# EAGLE design Switch Decoderv04a (EAGLE 8.2.2)
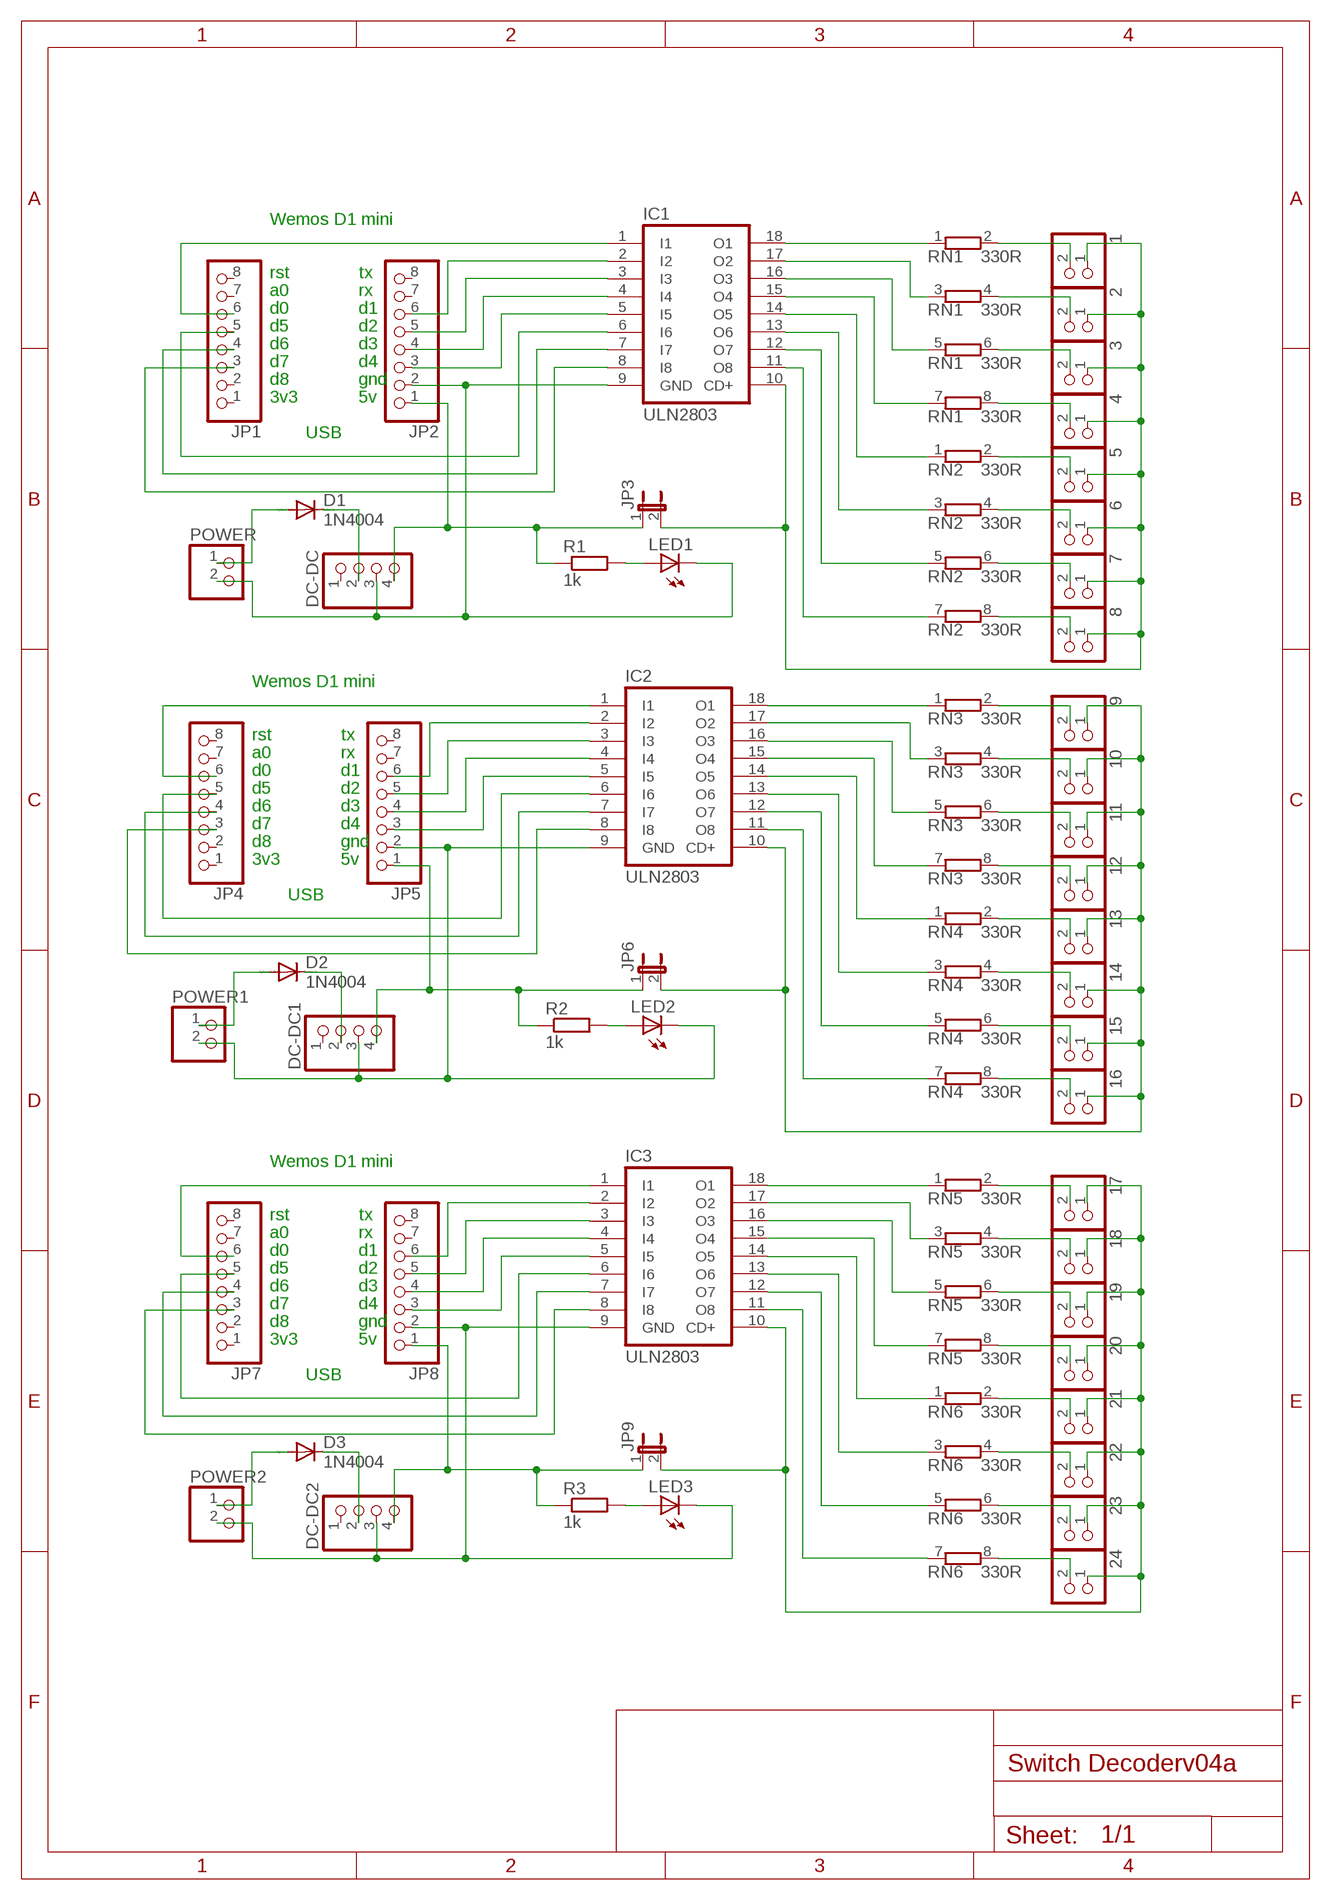
[diagram p0: schematic, sheet 1]

## Parts
1  PINHD-1X2  [1X02]
2  PINHD-1X2  [1X02]
3  PINHD-1X2  [1X02]
4  PINHD-1X2  [1X02]
5  PINHD-1X2  [1X02]
6  PINHD-1X2  [1X02]
7  PINHD-1X2  [1X02]
8  PINHD-1X2  [1X02]
9  PINHD-1X2  [1X02]
10  PINHD-1X2  [1X02]
11  PINHD-1X2  [1X02]
12  PINHD-1X2  [1X02]
13  PINHD-1X2  [1X02]
14  PINHD-1X2  [1X02]
15  PINHD-1X2  [1X02]
16  PINHD-1X2  [1X02]
17  PINHD-1X2  [1X02]
18  PINHD-1X2  [1X02]
19  PINHD-1X2  [1X02]
20  PINHD-1X2  [1X02]
21  PINHD-1X2  [1X02]
22  PINHD-1X2  [1X02]
23  PINHD-1X2  [1X02]
24  PINHD-1X2  [1X02]
D1  1N4004  [DO41-10]
D2  1N4004  [DO41-10]
D3  1N4004  [DO41-10]
DC-DC  PINHD-1X4  [1X04]
DC-DC1  PINHD-1X4  [1X04]
DC-DC2  PINHD-1X4  [1X04]
IC1  ULN2803  ULN2803A  [DIL18]
IC2  ULN2803  ULN2803A  [DIL18]
IC3  ULN2803  ULN2803A  [DIL18]
JP1  PINHD-1X8  [1X08]
JP2  PINHD-1X8  [1X08]
JP3  JP1E  [JP1]
JP4  PINHD-1X8  [1X08]
JP5  PINHD-1X8  [1X08]
JP6  JP1E  [JP1]
JP7  PINHD-1X8  [1X08]
JP8  PINHD-1X8  [1X08]
JP9  JP1E  [JP1]
LED1  LED3MM  [LED3MM]
LED2  LED3MM  [LED3MM]
LED3  LED3MM  [LED3MM]
POWER  PINHD-1X2  [1X02]
POWER1  PINHD-1X2  [1X02]
POWER2  PINHD-1X2  [1X02]
R1  1k  R-EU_0309/10  [0309/10]
R2  1k  R-EU_0309/10  [0309/10]
R3  1k  R-EU_0309/10  [0309/10]
RN1  330R  E4RP  [SIL8]
RN2  330R  E4RP  [SIL8]
RN3  330R  E4RP  [SIL8]
RN4  330R  E4RP  [SIL8]
RN5  330R  E4RP  [SIL8]
RN6  330R  E4RP  [SIL8]

## Nets
N$1 [Gnd]: DC-DC.3 IC1.9(GND) JP2.2 LED1.K(C) POWER.2
N$2: IC1.1(I1) JP1.6
N$3: IC1.7(I7) JP1.4
N$4 [5V]: D1.C DC-DC.2
N$5: IC1.6(I6) JP1.5
N$6: LED1.A R1.2
N$7: IC1.3(I3) JP2.5
N$8 [5V]: 1.1 2.1 3.1 4.1 5.1 6.1 7.1 8.1 IC1.10(CD+) JP3.2
N$9: IC1.5(I5) JP2.3
N$10: IC1.2(I2) JP2.6
N$11: IC1.8(I8) JP1.3
N$12: IC1.18(O1) RN1.1
N$13: IC1.4(I4) JP2.4
N$14: IC2.1(I1) JP4.6
N$15 [Gnd]: 1.2 RN1.2
N$16 [5V]: 9.1 10.1 11.1 12.1 13.1 14.1 15.1 16.1 IC2.10(CD+) JP6.2
N$17 [Gnd]: IC1.17(O2) RN1.3
N$18 [Gnd]: 2.2 RN1.4
N$19 [Gnd]: 3.2 RN1.6
N$20 [Gnd]: IC1.16(O3) RN1.5
N$21 [Gnd]: IC1.15(O4) RN1.7
N$22 [Gnd]: 4.2 RN1.8
N$23 [Gnd]: 5.2 RN2.2
N$24 [Gnd]: IC1.14(O5) RN2.1
N$25 [Gnd]: IC1.13(O6) RN2.3
N$26 [Gnd]: 6.2 RN2.4
N$27 [Gnd]: 7.2 RN2.6
N$28 [Gnd]: IC1.12(O7) RN2.5
N$29 [Gnd]: 8.2 RN2.8
N$30: LED2.A R2.2
N$31: IC2.2(I2) JP5.6
N$32: IC2.3(I3) JP5.5
N$33: IC2.4(I4) JP5.4
N$34 [5V]: D2.A POWER1.1
N$35 [5V]: D2.C DC-DC1.2
N$36: IC2.5(I5) JP5.3
N$37: IC2.6(I6) JP4.5
N$38: IC2.7(I7) JP4.4
N$39: IC2.8(I8) JP4.3
N$40: IC3.18(O1) RN5.1
N$41 [Gnd]: DC-DC1.3 IC2.9(GND) JP5.2 LED2.K(C) POWER1.2
N$42: IC1.11(O8) RN2.7
N$43 [Gnd]: IC2.11(O8) RN4.7
N$44: IC2.18(O1) RN3.1
N$45 [Gnd]: IC2.17(O2) RN3.3
N$46 [Gnd]: 9.2 RN3.2
N$47 [5V]: D1.A POWER.1
N$48 [Gnd]: 10.2 RN3.4
N$49 [Gnd]: IC2.16(O3) RN3.5
N$50 [Gnd]: IC2.15(O4) RN3.7
N$51 [Gnd]: 11.2 RN3.6
N$52 [Gnd]: 12.2 RN3.8
N$53 [Gnd]: IC2.14(O5) RN4.1
N$54 [Gnd]: IC2.13(O6) RN4.3
N$55 [Gnd]: 13.2 RN4.2
N$56 [Gnd]: 14.2 RN4.4
N$57 [Gnd]: IC2.12(O7) RN4.5
N$58 [Gnd]: 15.2 RN4.6
N$59: IC3.1(I1) JP7.6
N$60: LED3.A R3.2
N$61: IC3.2(I2) JP8.6
N$62: IC3.3(I3) JP8.5
N$63: IC3.4(I4) JP8.4
N$64 [5V]: D3.A POWER2.1
N$65 [5V]: D3.C DC-DC2.2
N$66: IC3.5(I5) JP8.3
N$67: IC3.6(I6) JP7.5
N$68: IC3.7(I7) JP7.4
N$69: IC3.8(I8) JP7.3
N$70 [5V]: 17.1 18.1 19.1 20.1 21.1 22.1 23.1 24.1 IC3.10(CD+) JP9.2
N$71 [Gnd]: DC-DC2.3 IC3.9(GND) JP8.2 LED3.K(C) POWER2.2
N$72 [Gnd]: 16.2 RN4.8
N$73 [Gnd]: IC3.11(O8) RN6.7
N$74 [5V]: DC-DC.4 JP2.1 JP3.1 R1.1
N$75 [Gnd]: IC3.17(O2) RN5.3
N$76 [5V]: DC-DC1.4 JP5.1 JP6.1 R2.1
N$77 [5V]: DC-DC2.4 JP8.1 JP9.1 R3.1
N$78 [Gnd]: IC3.16(O3) RN5.5
N$79 [Gnd]: IC3.15(O4) RN5.7
N$81 [Gnd]: 17.2 RN5.2
N$82 [Gnd]: IC3.14(O5) RN6.1
N$83 [Gnd]: IC3.13(O6) RN6.3
N$84 [Gnd]: 18.2 RN5.4
N$85 [Gnd]: 19.2 RN5.6
N$86 [Gnd]: IC3.12(O7) RN6.5
N$87 [Gnd]: 20.2 RN5.8
N$88 [Gnd]: 21.2 RN6.2
N$89 [Gnd]: 22.2 RN6.4
N$90 [extra]: 23.2 RN6.6
N$91 [Gnd]: 24.2 RN6.8
Unconnected: DC-DC1.1 DC-DC2.1 DC-DC.1 JP1.1 JP1.2 JP1.7 JP1.8 JP2.7 JP2.8 JP4.1 JP4.2 JP4.7 JP4.8 JP5.7 JP5.8 JP7.1 JP7.2 JP7.7 JP7.8 JP8.7 JP8.8

## Notes on the sheet
- Wemos D1 mini
- rst | tx
- a0 | rx
- d0 | d1
- d5 | d2
- d6 | d3
- d7 | d4
- d8 | gnd
- 3v3 | 5v
- USB
- Wemos D1 mini
- rst | tx
- a0 | rx
- d0 | d1
- d5 | d2
- d6 | d3
- d7 | d4
- d8 | gnd
- 3v3 | 5v
- USB
- Wemos D1 mini
- rst | tx
- a0 | rx
- d0 | d1
- d5 | d2
- d6 | d3
- d7 | d4
- d8 | gnd
- 3v3 | 5v
- USB

## Library data of the parts
1-24 POWER POWER1 POWER2 = pinhead:PINHD-1X2: PIN HEADER
D1-D3 = diode:1N4004: DIODE general purpose rectifier, 1 A
DC-DC DC-DC1 DC-DC2 = pinhead:PINHD-1X4: PIN HEADER
IC1-IC3 = uln-udn:ULN2803A: DRIVER ARRAY
JP1 JP2 JP4 JP5 JP7 JP8 = pinhead:PINHD-1X8: PIN HEADER
JP3 JP6 JP9 = jumper:JP1E: JUMPER
LED1-LED3 = led:LED: LED OSRAM: - CHIPLED LG R971, LG N971, LY N971, LG Q971, LY Q971, LO R971, LY R971 LH N974, LH R974 LS Q976, LO Q976, LY Q976 LO Q996 - Hyper CHIPLED LW Q18S LB Q993, LB Q99A, LB R99A - SideLED LS A670, LO A670, LY A670, LG A670, LP A670 LB A673, LV A673, LT A673, LW A673 LH A674 LY A675 LS A676, LA A676, LO A676, LY A676, LW A676 LS A679, LY A679, LG A679 - Hyper Micro SIDELED® LS Y876, LA Y876, LO Y876, LY Y876 LT Y87S - SmartLED LW L88C, LW L88S LB L89C, LB L89S, LG L890 LS L89K, LO L89K, LY L89K LS L896, LA L896, LO L896, LY L896 - TOPLED LS T670, LO T670, LY T670, LG T670, LP T670 LSG T670, LSP T670, LSY T670, LOP T670, LYG T670 LG T671, LOG T671, LSG T671 LB T673, LV T673, LT T673, LW T673 LH T674 LS T676, LA T676, LO T676, LY T676, LB T676, LH T676, LSB T676, LW T676 LB T67C, LV T67C, LT T67C, LS T67K, LO T67K, LY T67K, LW E67C LS E67B, LA E67B, LO E67B, LY E67B, LB E67C, LV E67C, LT E67C LW T67C LS T679, LY T679, LG T679 LS T770, LO T770, LY T770, LG T770, LP T770 LB T773, LV T773, LT T773, LW T773 LH T774 LS E675, LA E675, LY E675, LS T675 LS T776, LA T776, LO T776, LY T776, LB T776 LHGB T686 LT T68C, LB T68C - Hyper Mini TOPLED® LB M676 - Mini TOPLED Santana® LG M470 LS M47K, LO M47K, LY M47K Source: http://www.osram.convergy.de LUXEON: - LUMILED® LXK2-PW12-R00, LXK2-PW12-S00, LXK2-PW14-U00, LXK2-PW14-V00 LXK2-PM12-R00, LXK2-PM12-S00, LXK2-PM14-U00 LXK2-PE12-Q00, LXK2-PE12-R00, LXK2-PE12-S00, LXK2-PE14-T00, LXK2-PE14-U00 LXK2-PB12-K00, LXK2-PB12-L00, LXK2-PB12-M00, LXK2-PB14-N00, LXK2-PB14-P00, LXK2-PB14-Q00 LXK2-PR12-L00, LXK2-PR12-M00, LXK2-PR14-Q00, LXK2-PR14-R00 LXK2-PD12-Q00, LXK2-PD12-R00, LXK2-PD12-S00 LXK2-PH12-R00, LXK2-PH12-S00 LXK2-PL12-P00, LXK2-PL12-Q00, LXK2-PL12-R00 Source: www.luxeon.com KINGBRIGHT: KA-3528ASYC Source: www.kingbright.com
R1-R3 = resistor:R-EU_: RESISTOR, European symbol
RN1-RN6 = resistor-sil:E4RP: SIL RESISTOR; OC_FARNELL: unknown; OC_NEWARK: unknown

## Net classes
0 default: width 0.508 mm, clearance 0.254 mm
1 5V: width 0.508 mm, clearance 0.254 mm
2 Gnd: width 0.508 mm, clearance 0.254 mm
3 extra: width 0.508 mm, clearance 0.254 mm
4 3.3V: width 0.508 mm, clearance 0.254 mm

## Board
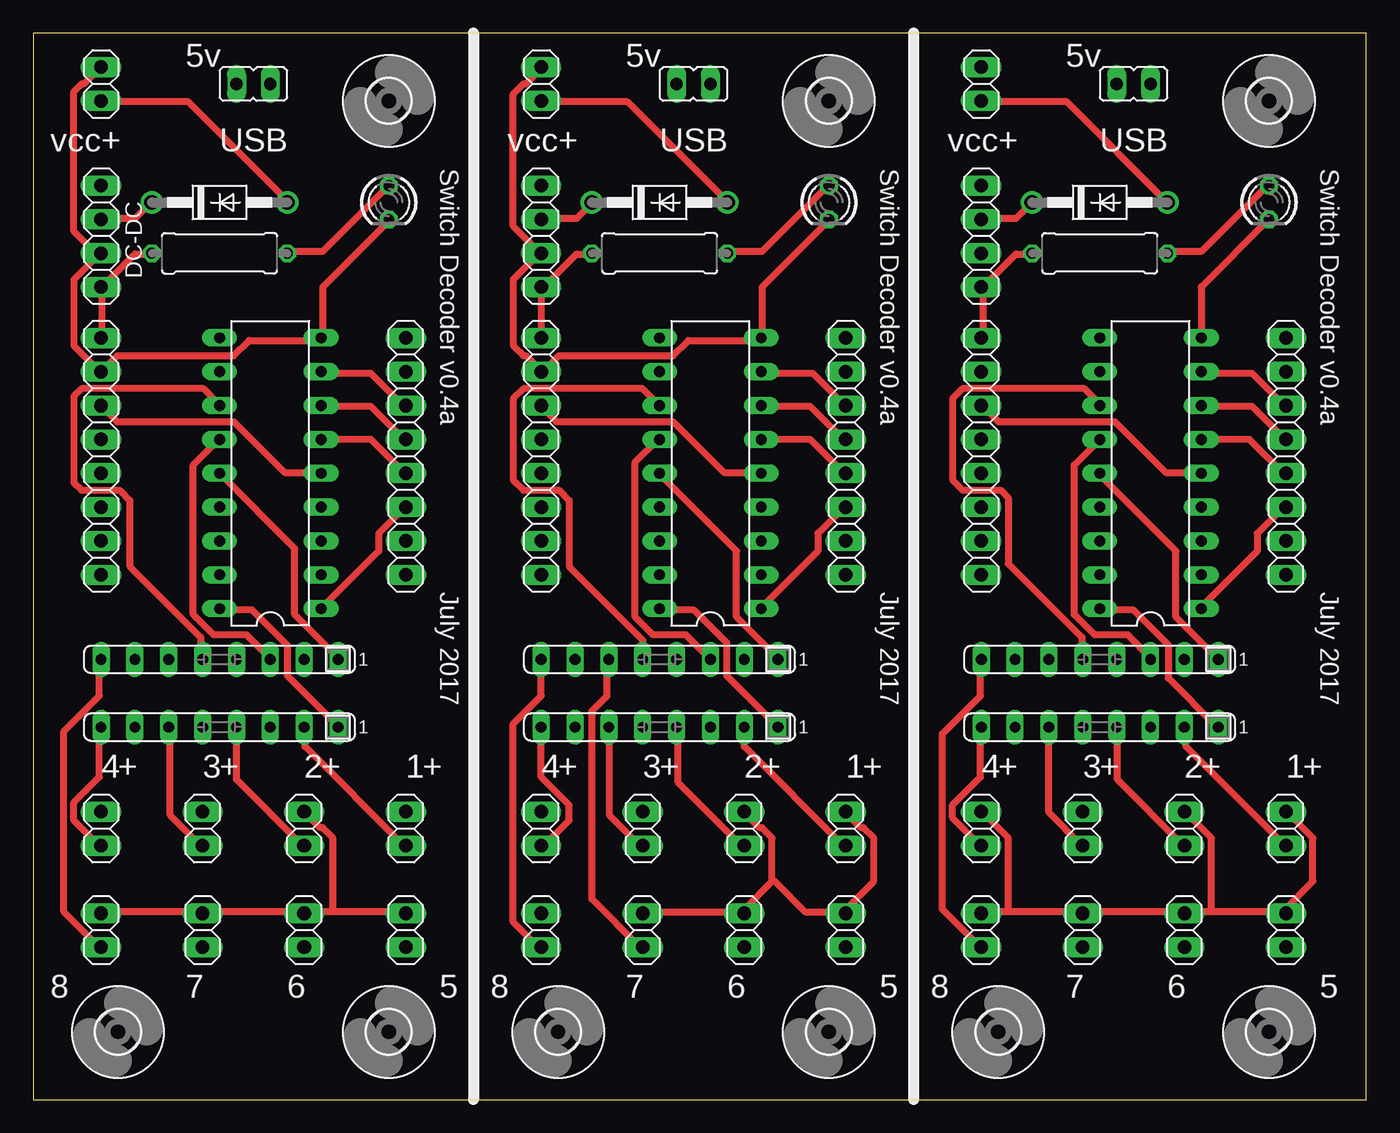
[diagram p1: board, top side]
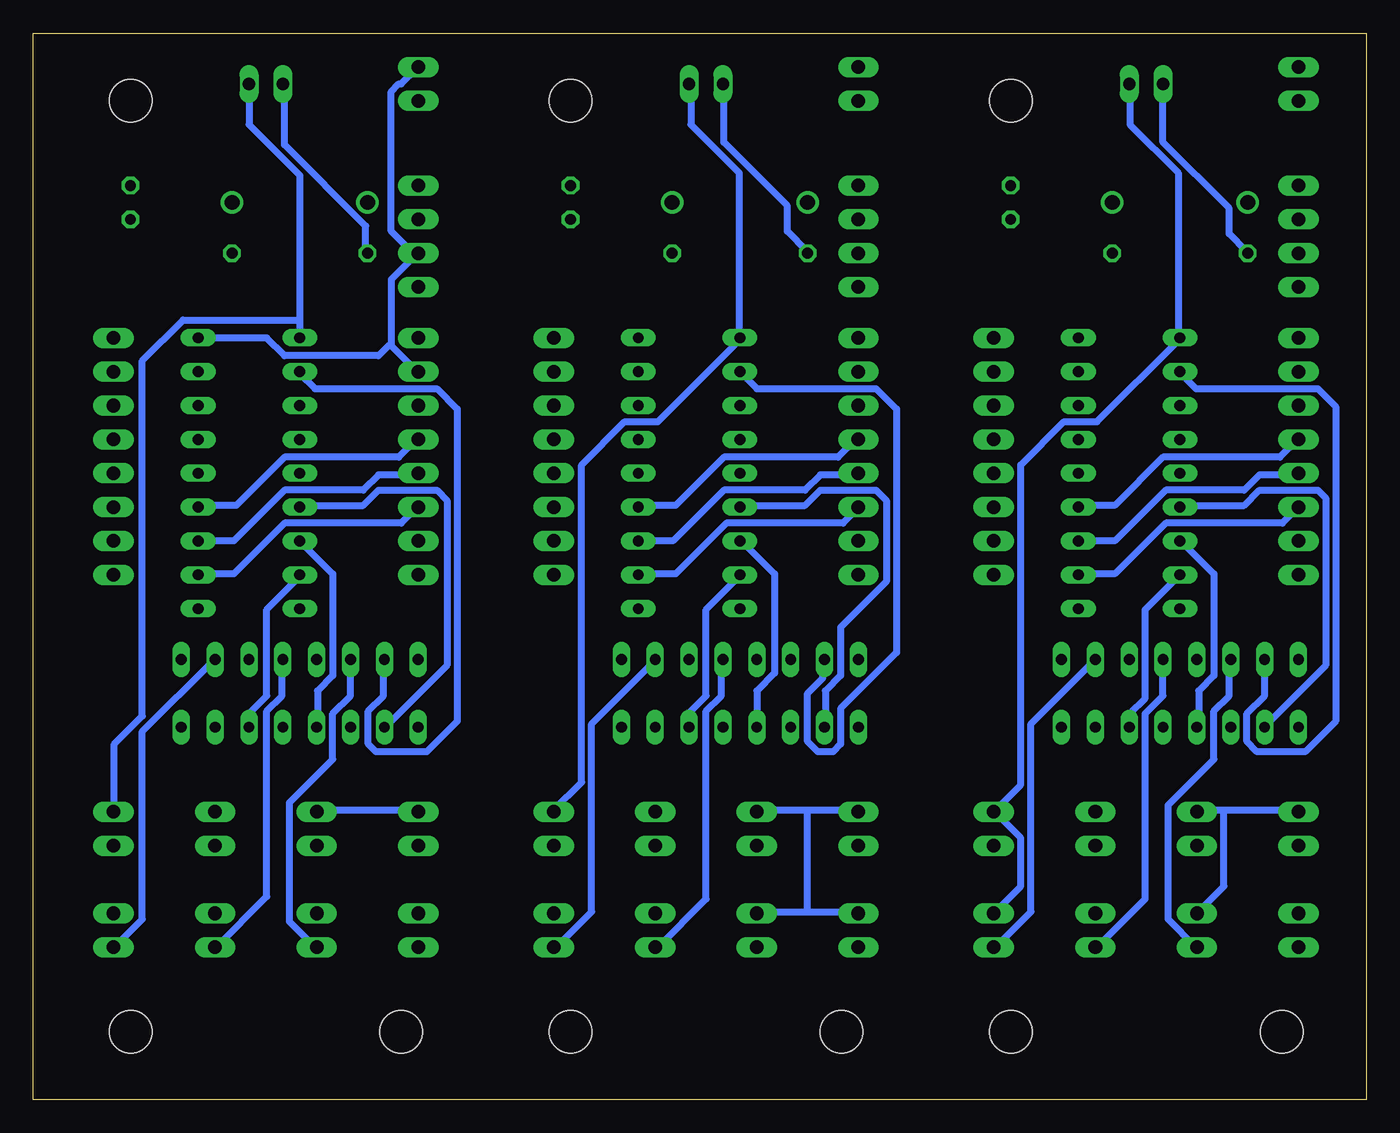
[diagram p2: board, bottom side, seen from below]

Size 100 x 80 mm. Coordinates in mm from the lower left corner, seen from the top.
Outline: 0,0 100,0 100,80 0,80 0,0
Copper layers (1*16): Top 0.035mm / dielectric 1.5mm / Bottom 0.035mm
Design rules "NOA Eagle Rule 2016-06-12": minimum track width 6mil, minimum drill 0.3mm, track to track 6mil, track to pad 6mil, pad to pad 6mil, via to via 6mil, smd to smd 0mil, copper to edge 0.4mm, drill to drill 10mil, minimum pad ring 10mil, minimum via ring 6mil, stop-mask expansion 2mil, vias tented up to drill 25mil, thermal gap 10mil
tRestrict: 2 lines
bRestrict: 2 lines

### Footprints (pad centres in the part's own frame; a part is rotated, then mirrored left to right if it is on the bottom)
1X02 = drill 1.016 long: 1 -1.27,0; 2 1.27,0
DO41-10 = drill 1.118: A 5.08,0; C -5.08,0
1X04 = drill 1.016 long: 1 -3.81,0; 2 -1.27,0; 3 1.27,0; 4 3.81,0
DIL18 = drill 0.813 long: 1 -10.16,-3.81; 2 -7.62,-3.81; 3 -5.08,-3.81; 4 -2.54,-3.81; 5 0,-3.81; 6 2.54,-3.81; 7 5.08,-3.81; 8 7.62,-3.81; 9 10.16,-3.81; 10 10.16,3.81; 11 7.62,3.81; 12 5.08,3.81; 13 2.54,3.81; 14 0,3.81; 15 -2.54,3.81; 16 -5.08,3.81; 17 -7.62,3.81; 18 -10.16,3.81
1X08 = drill 1.016 long: 1 -8.89,0; 2 -6.35,0; 3 -3.81,0; 4 -1.27,0; 5 1.27,0; 6 3.81,0; 7 6.35,0; 8 8.89,0
JP1 = drill 0.914 long: 1 0,-1.27; 2 0,1.27
LED3MM = drill 0.813 octagon: A -1.27,0; K 1.27,0
0309/10 = drill 0.813 octagon: 1 -5.08,0; 2 5.08,0
SIL8 = drill 0.813 long: 1 -8.89,0; 2 -6.35,0; 3 -3.81,0; 4 -1.27,0; 5 1.27,0; 6 3.81,0; 7 6.35,0; 8 8.89,0
3,2 = hole 3.2: 0,0

### Placement (x,y rotation side)
1  27.94,20.32 270 top
2  20.32,20.32 270 top
3  12.7,20.32 270 top
4  5.08,20.32 270 top
5  27.94,12.7 270 top
6  20.32,12.7 270 top
7  12.7,12.7 270 top
8  5.08,12.7 270 top
9  60.96,20.32 270 top
10  53.34,20.32 270 top
11  45.72,20.32 270 top
12  38.1,20.32 270 top
13  60.96,12.7 270 top
14  53.34,12.7 270 top
15  45.72,12.7 270 top
16  38.1,12.7 270 top
17  93.98,20.32 270 top
18  86.36,20.32 270 top
19  78.74,20.32 270 top
20  71.12,20.32 270 top
21  93.98,12.7 270 top
22  86.36,12.7 270 top
23  78.74,12.7 270 top
24  71.12,12.7 270 top
D1  13.97,67.31 0 top
D2  46.99,67.31 0 top
D3  80.01,67.31 0 top
DC-DC  5.08,64.77 270 top
DC-DC1  38.1,64.77 270 top
DC-DC2  71.12,64.77 270 top
IC1  17.78,46.99 90 top
IC2  50.8,46.99 90 top
IC3  83.82,46.99 90 top
JP1  27.94,48.26 270 top
JP2  5.08,48.26 270 top
JP3  16.51,76.2 270 top
JP4  60.96,48.26 270 top
JP5  38.1,48.26 270 top
JP6  49.53,76.2 270 top
JP7  93.98,48.26 270 top
JP8  71.12,48.26 270 top
JP9  82.55,76.2 270 top
LED1  26.67,67.31 270 top
LED2  59.69,67.31 270 top
LED3  92.71,67.31 270 top
POWER  5.08,76.2 90 top
POWER1  38.1,76.2 90 top
POWER2  71.12,76.2 90 top
R1  13.97,63.5 0 top
R2  46.99,63.5 0 top
R3  80.01,63.5 0 top
RN1  13.97,27.94 180 top
RN2  13.97,33.02 180 top
RN3  46.99,27.94 180 top
RN4  46.99,33.02 180 top
RN5  80.01,27.94 180 top
RN6  80.01,33.02 180 top
U$1  [3,2]  26.67,74.93 0 top
U$2  [3,2]  59.69,74.93 0 top
U$3  [3,2]  6.35,5.08 0 top
U$4  [3,2]  26.67,5.08 0 top
U$5  [3,2]  92.71,74.93 0 top
U$6  [3,2]  39.37,5.08 0 top
U$7  [3,2]  59.69,5.08 0 top
U$8  [3,2]  72.39,5.08 0 top
U$9  [3,2]  92.71,5.08 0 top

### Tracks (layer width: path | path; a pad name or v marks a point on that pad's centre or on a via)
N$1
  Top 0.508: LED1.K 26.67,65.91 21.72,60.96 21.72,57.15 IC1.9 21.53,56.96 16.19,56.96 15.05,55.82 6.29,55.82 JP2.2 4.95,54.67 3.05,56.58 3.05,61.53 4.95,63.44 DC-DC.3 4.76,63.44 3.05,65.15 3.05,75.63 3.62,76.2 3.81,76.2 POWER.2
N$2
  Top 0.508: IC1.1 25.91,41.15 25.91,42.48 27.81,44.39 JP1.6
N$3
  Top 0.508: IC1.7 21.72,52.01 25.34,52.01 27.81,49.53 JP1.4
N$4
  Top 0.508: DC-DC.2 5.14,66.1 7.62,66.1 8.76,67.25 D1.C
N$5
  Top 0.508: IC1.6 25.34,49.53 27.81,47.05 JP1.5
N$6
  Top 0.508: LED1.A 21.72,63.63 19.05,63.63 R1.2
N$7
  Bottom 0.508: IC1.3 18.86,41.91 15.05,45.72 9.14,45.72 8,46.86 5.14,46.86 JP2.5
N$8
  Top 0.508: 8.1 5.14,14.1 12.57,14.1 7.1 12.76,14.1 20.19,14.1 6.1 20.38,14.1 22.48,14.1 | 22.48,14.1 27.81,14.1 5.1 | 2.1 21.53,20.38 21.72,20.38 22.48,19.62 22.48,14.1
  Bottom 0.508: JP3.2 17.72,76.2 17.72,73.15 14.1,69.53 14.1,57.15 IC1.10 14.1,56.96 20.19,50.86 22.67,50.86 25.91,47.62 25.91,23.62 1.1 27.81,21.53 25.91,19.62 25.91,16 5.1 | 10.67,21.72 12.57,21.72 3.1 | 10.67,21.72 5.14,21.72 4.1 | 10.67,21.72 10.67,16 7.1
N$9
  Top 0.508: JP2.3 6.29,50.86 15.05,50.86 18.86,47.05 21.53,47.05 IC1.5
N$10
  Bottom 0.508: JP2.6 6.29,43.24 15.05,43.24 18.86,39.43 21.53,39.43 IC1.2
N$11
  Top 0.508: IC1.8 21.72,54.48 25.34,54.48 27.81,52.01 JP1.3
N$12
  Top 0.508: RN1.1 22.86,28 19.05,31.81 19.05,34.1 16.38,36.77 14.1,36.77 IC1.18
N$13
  Bottom 0.508: IC1.4 21.53,44.58 18.86,44.58 15.24,48.2 6.48,48.2 5.14,49.53 JP2.4
N$14
  Top 0.508: IC2.1 54.67,36.96 58.86,41.15 58.86,42.48 60.96,44.58 JP4.6
N$15
  Top 0.508: RN1.2 20.38,27.81 20.38,26.48 27.81,19.05 1.2
N$16
  Top 0.508: 15.1 45.72,14.1 53.34,14.1 14.1 53.34,14.29 55.44,16.38 | 55.44,16.38 55.44,19.62 54.67,20.38 54.48,20.38 53.34,21.53 10.1 | 55.44,16.38 55.63,16.38 57.91,14.1 60.96,14.1 13.1 60.96,14.29 63.06,16.38 63.06,19.62 62.29,20.38 62.1,20.38 60.96,21.53 9.1
  Bottom 0.508: JP6.2 50.67,76.2 50.67,73.15 47.05,69.53 47.05,57.15 IC2.10 47.05,56.96 53.15,50.86 55.63,50.86 58.86,47.62 58.86,23.81 60.96,21.72 9.1 | 41.91,21.72 45.72,21.72 11.1 | 41.91,21.72 38.1,21.72 12.1 | 41.91,14.1 45.72,14.1 15.1 | 41.91,14.1 38.1,14.1 16.1 | 41.91,14.1 41.91,21.72
N$17
  Bottom 0.508: IC1.17 16.57,36.77 16.57,30.1 17.72,28.96 17.72,28 RN1.3
N$18
  Top 0.508: RN1.4 15.24,24 20.19,19.05 2.2
N$19
  Top 0.508: RN1.6 10.29,27.81 10.29,21.34 12.57,19.05 3.2
N$20
  Bottom 0.508: RN1.5 12.57,28 12.57,30.67 11.43,31.81 11.43,39.43 13.91,41.91 IC1.16
N$21
  Bottom 0.508: RN1.7 7.62,28 3.05,32.58 3.05,45.15 3.62,45.72 8,45.72 9.14,44.58 13.91,44.58 IC1.15
N$22
  Top 0.508: RN1.8 4.95,27.81 4.95,24.19 3.05,22.29 3.05,20.95 4.95,19.05 4.2
N$23
  Bottom 0.508: RN2.2 25.15,28.19 25.15,14.1 27.81,11.43 5.2
N$24
  Top 0.508: IC1.14 19.62,41.34 19.62,36.39 22.86,33.15 RN2.1
N$25
  Top 0.508: IC1.13 13.91,49.53 12,47.62 12,36.39 13.53,34.86 16,34.86 17.72,33.15 RN2.3
N$26
  Bottom 0.508: RN2.4 15.24,30.29 16.57,28.96 16.57,15.05 20.19,11.43 6.2
N$27
  Bottom 0.508: RN2.6 10.29,32.96 10.29,30.29 11.43,29.15 11.43,25.53 14.86,22.1 14.86,13.53 12.76,11.43 7.2
N$28
  Top 0.508: RN2.5 12.57,33.15 12.57,34.67 7.24,40.01 7.24,44.96 6.48,45.72 3.62,45.72 3.05,46.29 3.05,52.77 3.62,53.34 12.76,53.34 13.91,52.2 IC1.12
N$29
  Top 0.508: RN2.8 4.95,32.96 4.95,30.29 2.29,27.62 2.29,14.1 4.95,11.43 8.2
N$30
  Top 0.508: R2.2 52.2,63.63 54.67,63.63 59.63,68.58 LED2.A
N$31
  Bottom 0.508: IC2.2 54.48,39.43 51.82,39.43 48.01,43.24 39.24,43.24 38.1,44.39 JP5.6
N$32
  Bottom 0.508: IC2.3 52.01,41.91 48.2,45.72 42.1,45.72 40.96,46.86 38.1,46.86 JP5.5
N$33
  Bottom 0.508: JP5.4 38.29,49.53 39.62,48.2 48.2,48.2 51.82,44.58 54.48,44.58 IC2.4
N$34
  Top 0.508: POWER1.1 38.1,74.87 44.58,74.87 52.01,67.44 D2.A
N$35
  Top 0.508: DC-DC1.2 38.1,66.1 40.77,66.1 41.91,67.25 D2.C
N$36
  Top 0.508: IC2.5 54.48,47.05 51.82,47.05 48.01,50.86 39.24,50.86 38.1,52.01 JP5.3
N$37
  Top 0.508: IC2.6 58.29,49.53 60.96,46.86 JP4.5
N$38
  Top 0.508: JP4.4 60.77,49.53 58.29,52.01 54.67,52.01 IC2.7
N$39
  Top 0.508: IC2.8 54.67,54.48 58.48,54.48 60.96,52.01 JP4.3
N$40
  Top 0.508: RN5.1 88.77,28 85.15,31.62 85.15,34.1 82.49,36.77 80.01,36.77 IC3.18
N$41
  Top 0.508: LED2.K 59.63,65.91 54.67,60.96 54.67,57.15 IC2.9 54.48,56.96 49.15,56.96 48.01,55.82 39.43,55.82 38.29,54.67 JP5.2 38.1,54.67 36.96,55.82 36.77,55.82 36.01,56.58 36.01,61.53 38.1,63.63 DC-DC1.3 37.91,63.63 36.01,65.53 36.01,75.44 36.77,76.2 36.96,76.2 38.1,77.34 POWER1.2
N$42
  Bottom 0.508: RN2.7 7.62,30.29 8.95,28.96 8.95,26.86 8.19,26.1 4.57,26.1 2.29,28.38 2.29,52.01 3.62,53.34 12.76,53.34 13.91,54.48 IC1.11
N$43
  Bottom 0.508: IC2.11 45.72,53.34 36.77,53.34 35.24,51.82 35.24,33.53 39.43,29.34 39.43,26.67 40.01,26.1 41.15,26.1 41.91,26.86 41.91,30.48 40.77,31.62 40.77,32.96 RN4.7
N$44
  Top 0.508: RN3.1 52.01,31.81 52.01,34.29 49.53,36.77 47.05,36.77 IC2.18
N$45
  Bottom 0.508: IC2.17 47.05,39.24 49.53,36.77 49.53,30.29 50.67,29.15 50.67,28 RN3.3
N$46
  Top 0.508: RN3.2 53.34,26.48 60.77,19.05 9.2
N$47
  Top 0.508: POWER.1 5.14,74.87 11.62,74.87 19.05,67.44 D1.A
N$48
  Top 0.508: 10.2 53.15,19.05 48.39,23.81 48.39,27.81 RN3.4
N$49
  Bottom 0.508: RN3.5 45.72,30.67 44.39,32 44.39,39.43 46.86,41.91 IC2.16
N$50
  Bottom 0.508: RN3.7 40.58,28 40.58,30.67 39.43,31.81 39.43,35.43 36.01,38.86 36.01,44.96 36.77,45.72 40.96,45.72 42.1,44.58 46.86,44.58 IC2.15
N$51
  Top 0.508: 11.2 45.53,19.05 43.24,21.34 43.24,27.81 RN3.6
N$52
  Top 0.508: RN3.8 38.1,24.19 40.2,22.1 40.2,20.95 38.29,19.05 12.2
N$53
  Top 0.508: IC2.14 47.05,46.86 52.77,41.15 52.77,36.2 55.82,33.15 RN4.1
N$54
  Top 0.508: RN4.3 48.96,34.86 46.48,34.86 45.15,36.2 45.15,47.82 46.86,49.53 IC2.13
N$55
  Bottom 0.508: 13.2 60.77,11.43 58.1,14.1 58.1,28.19 53.34,32.96 RN4.2
N$56
  Bottom 0.508: 14.2 53.15,11.43 49.53,15.05 49.53,29.15 48.39,30.29 48.39,32.96 RN4.4
N$57
  Top 0.508: RN4.5 45.72,34.48 40.2,40.01 40.2,44.96 39.43,45.72 36.77,45.72 36.01,46.48 36.01,52.58 36.77,53.34 45.72,53.34 IC2.12
N$58
  Top 0.508: 15.2 45.53,11.43 41.91,15.05 41.91,29.15 43.05,30.29 43.05,32.96 RN4.6
N$59
  Top 0.508: IC3.1 87.63,36.96 91.82,41.15 91.82,42.48 93.92,44.58 JP7.6
N$60
  Top 0.508: R3.2 85.15,63.63 87.63,63.63 92.58,68.58 LED3.A
N$61
  Bottom 0.508: IC3.2 87.63,39.43 84.96,39.43 81.15,43.24 72.39,43.24 71.25,44.39 JP8.6
N$62
  Bottom 0.508: IC3.3 84.96,41.91 81.15,45.72 75.25,45.72 74.11,46.86 71.25,46.86 JP8.5
N$63
  Bottom 0.508: IC3.4 87.63,44.58 84.77,44.58 81.15,48.2 72.58,48.2 71.25,49.53 JP8.4
N$64
  Top 0.508: D3.A 77.53,74.87 71.25,74.87 POWER2.1
N$65
  Top 0.508: D3.C 73.72,66.1 71.25,66.1 DC-DC2.2
N$66
  Top 0.508: IC3.5 87.63,47.05 84.96,47.05 81.15,50.86 72.39,50.86 71.25,52.01 JP8.3
N$67
  Top 0.508: IC3.6 91.25,49.53 93.92,46.86 JP7.5
N$68
  Top 0.508: IC3.7 87.63,52.01 91.44,52.01 93.92,49.53 JP7.4
N$69
  Top 0.508: IC3.8 87.63,54.48 91.44,54.48 93.92,52.01 JP7.3
N$70
  Top 0.508: 73.15,14.1 78.68,14.1 23.1 78.87,14.1 86.3,14.1 22.1 86.49,14.1 88.39,14.1 | 73.15,14.1 71.25,14.1 24.1 | 88.39,14.1 93.92,14.1 21.1 93.92,14.29 96.01,16.38 96.01,19.62 94.11,21.53 17.1 | 88.39,14.1 88.39,19.62 86.49,21.53 18.1 | 73.15,14.1 73.15,19.62 71.25,21.53 20.1
  Bottom 0.508: 80.01,58.48 80.01,69.34 83.82,73.15 JP9.2 | 80.01,58.48 IC3.10 | 20.1 71.25,21.72 78.68,21.72 19.1 | 80.01,58.48 88.77,58.48 91.82,55.44 91.82,28.77 93.92,26.67 93.92,21.72 17.1
N$71
  Top 0.508: IC3.9 87.63,60.96 LED3.K
  Bottom 0.508: 73.15,56.58 71.25,54.67 JP8.2 | 73.15,56.58 73.15,61.53 71.25,63.44 DC-DC2.3 71.44,63.44 73.15,65.15 73.15,75.63 72.58,76.2 72.39,76.2 POWER2.2 | IC3.9 82.49,57.15 81.15,55.82 74.11,55.82 73.34,56.58 73.15,56.58
N$72
  Top 0.508: RN4.8 38.1,30.29 36.01,28.19 36.01,13.34 37.91,11.43 16.2
N$73
  Bottom 0.508: RN6.7 73.72,32.96 73.72,30.29 74.87,29.15 74.87,26.67 74.3,26.1 70.48,26.1 68.2,28.38 68.2,51.82 69.72,53.34 78.87,53.34 80.01,54.48 IC3.11
N$74
  Top 0.508: R1.1 8.76,63.44 7.62,63.44 5.14,60.96 DC-DC.4 5.14,60.77 5.14,57.15 JP2.1
  Bottom 0.508: JP3.1 15.24,71.82 10.29,66.86 10.29,64.96 8.95,63.63 R1.1
N$75
  Bottom 0.508: RN5.3 83.82,28.96 82.49,30.29 82.49,36.77 80.01,39.24 IC3.17
N$76
  Top 0.508: R2.1 41.91,63.44 40.77,63.44 38.29,60.96 DC-DC1.4 JP5.1
  Bottom 0.508: JP6.1 48.2,76.2 48.2,71.82 43.43,67.06 43.43,65.15 41.91,63.63 R2.1
N$77
  Top 0.508: R3.1 74.87,63.44 73.72,63.44 71.25,60.96 DC-DC2.4 71.25,60.77 71.25,57.15 JP8.1
  Bottom 0.508: JP9.1 81.15,76.2 81.15,71.63 75.06,65.53 75.06,63.63 R3.1
N$78
  Bottom 0.508: IC3.16 77.53,39.43 77.53,31.81 78.68,30.67 78.68,28 RN5.5
N$79
  Bottom 0.508: RN5.7 73.53,28 68.96,32.58 68.96,44.96 69.72,45.72 74.11,45.72 75.25,44.58 80.01,44.58 IC3.15
N$81
  Top 0.508: RN5.2 86.49,27.81 86.49,26.48 93.92,19.05 17.2
N$82
  Top 0.508: RN6.1 85.72,36.2 85.72,41.15 80.01,46.86 IC3.14
N$83
  Top 0.508: IC3.13 78.11,47.62 78.11,36.39 79.63,34.86 82.11,34.86 83.82,33.15 RN6.3
N$84
  Top 0.508: RN5.4 81.34,27.81 81.34,24 86.3,19.05 18.2
N$85
  Top 0.508: RN5.6 76.2,21.53 78.68,19.05 19.2
N$86
  Top 0.508: RN6.5 78.68,33.15 78.68,34.67 73.15,40.2 73.15,45.15 72.58,45.72 69.72,45.72 68.96,46.48 68.96,52.58 69.72,53.34 78.87,53.34 80.01,52.2 IC3.12
N$87
  Top 0.508: RN5.8 71.06,27.81 71.06,24.19 68.96,22.1 68.96,21.14 71.06,19.05 20.2
N$88
  Bottom 0.508: RN6.2 86.49,32.96 91.82,27.62 91.82,13.53 93.92,11.43 21.2
N$89
  Bottom 0.508: RN6.4 81.34,32.96 81.34,30.29 82.49,29.15 82.49,15.24 86.3,11.43 22.2
N$90
  Bottom 0.508: RN6.6 76.2,30.29 77.53,28.96 77.53,25.53 80.77,22.29 80.77,13.34 78.87,11.43 23.2
N$91
  Top 0.508: RN6.8 71.06,32.96 71.06,30.29 68.2,27.43 68.2,14.29 71.06,11.43 24.2

### Text on the board
tNames: 5v | 5v | 5v | vcc+ | USB | vcc+ | USB | vcc+ | USB | Switch Decoder v0.4a | Switch Decoder v0.4a | Switch Decoder v0.4a | July 2017 | July 2017 | July 2017 | 4 | + | 3 | + | 2 | + | 1 | + | 4 | + | 3 | + | 2 | + | 1 | + | 4 | + | 3 | + | 2 | + | 1 | + | 8 | 7 | 6 | 5 | 8 | 7 | 6 | 5 | 8 | 7 | 6 | 5